# Altium project B6_32D_20230729.PrjPcb
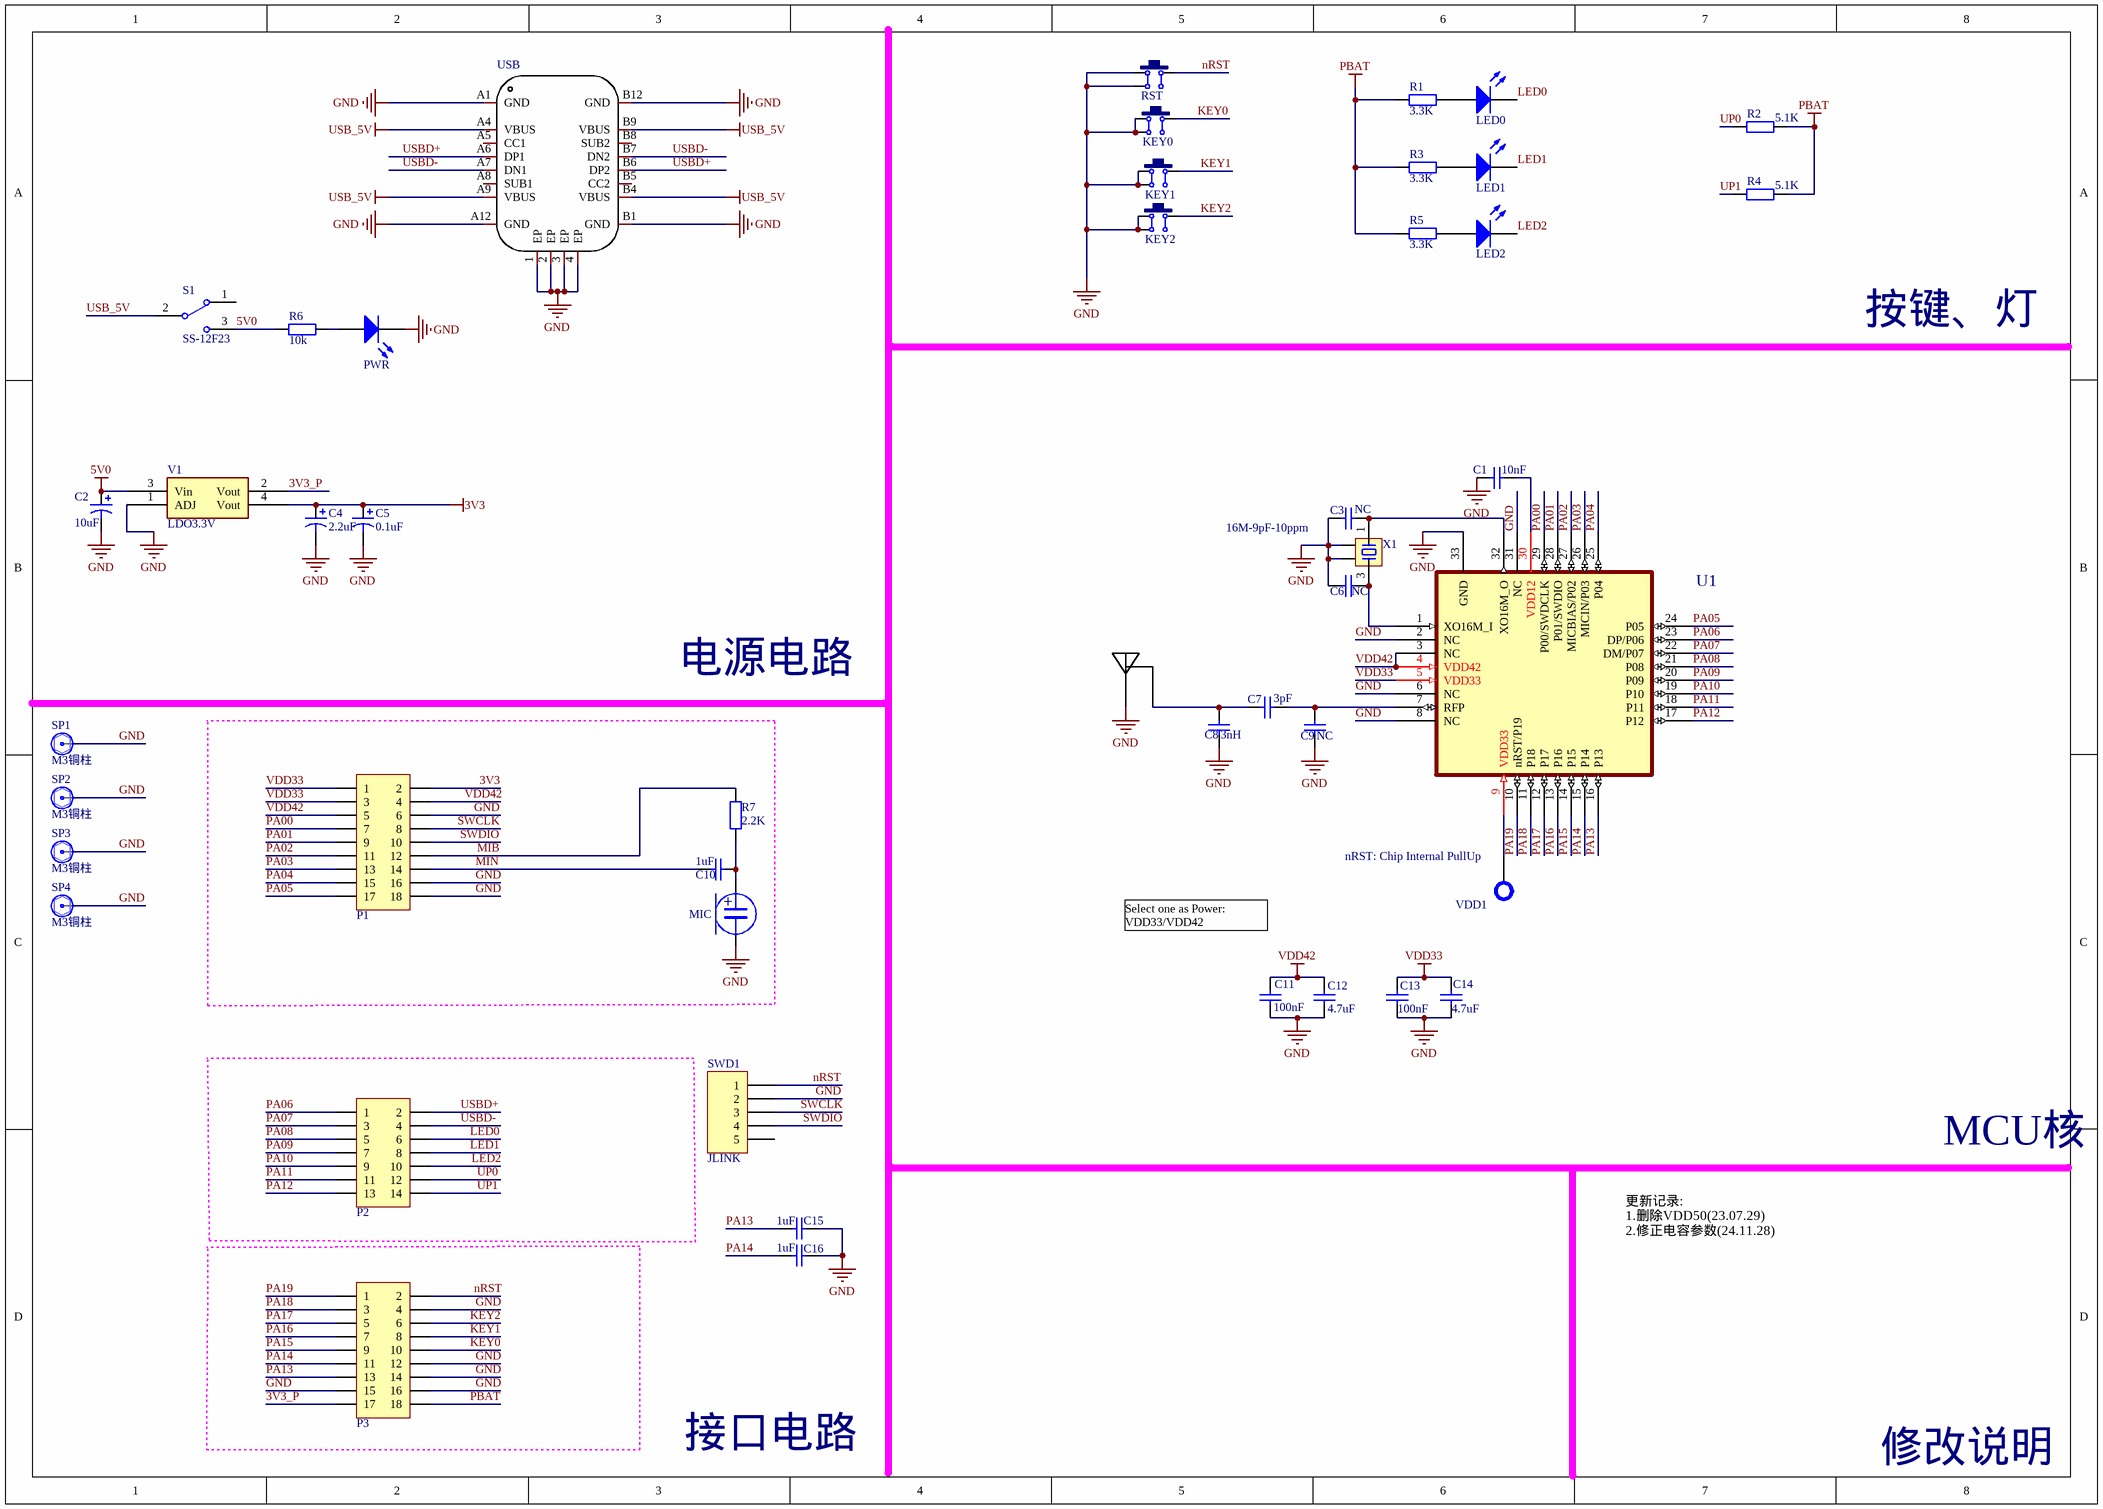
[diagram p0: B6_32D_20230729.SchDoc]
1 sheet, 47 parts. Net scope: global (net labels, ports and power ports of the same name join across sheets).
Board file: B6_32D_20230729.PcbDoc

## Sheet B6_32D_20230729.SchDoc: B6_32 Development Board
size A3; Date: 2023.07.28; Revision: V1.1; Rule: PcbType=ProtelPcb; Rule: PcbType=ProtelPcb; Rule: PcbType=ProtelPcb

### Parts
ANT1  ANT1  [常用2.4G天线7]  (value not drawn)
C1  10nF  [C0603]
C2  10uF  [C0603]
C3  NC  [C0603]
C4  2.2uF  [C0603]
C5  0.1uF  [C0603]
C6  NC  [C0603]
C7  3pF  [C0402]
C8  3nH  [C0402]
C9  NC  [C0402]
C10  1uF  [C0603]
C11  100nF  [C0603]
C12  4.7uF  [C0603]
C13  100nF  [C0603]
C14  4.7uF  [C0603]
C15  1uF  [C0603]
C16  1uF  [C0603]
KEY0  6x6x5  [SW-SMD]  (value not drawn)
KEY1  6x6x5  [SW-SMD]  (value not drawn)
KEY2  6x6x5  [SW-SMD]  (value not drawn)
LED0  *  [LED_0603]  (value not drawn)
LED1  *  [LED_0603]  (value not drawn)
LED2  *  [LED_0603]  (value not drawn)
MIC  MIC-6*5mm  [MIC-6*5.5mm]  (value not drawn)
P1  Header 2X11  [HDR2.54-LI-2x9P]  (value not drawn)
P2  Header 2X7  [HDR2.54-LI-2x7P]  (value not drawn)
P3  Header 2X11  [HDR2.54-LI-2x9P]  (value not drawn)
PWR  *  [LED_0603]  (value not drawn)
R1  3.3K  [R 0603_L]
R2  5.1K  [R 0603_L]
R3  3.3K  [R 0603_L]
R4  5.1K  [R 0603_L]
R5  3.3K  [R 0603_L]
R6  10k  [RESC_0603]
R7  2.2K  [R 0603_L]
RST  6x6x5  [SW-SMD]  (value not drawn)
S1  SS-12F23  [SK12D07VG3]
SP1  M3铜柱  [M3x21+6_L]
SP2  M3铜柱  [M3x21+6_L]
SP3  M3铜柱  [M3x21+6_L]
SP4  M3铜柱  [M3x21+6_L]
SWD1  JLINK  [HDR2.54-LI-5P]
U1  C1_QFN32  [QFN32L_0404x0.75-0.40]  (value not drawn)
USB  KH-TYPE-C-16P  [USB-C-SMD_KH-TYPE-C-16P]  (value not drawn)
V1  LDO3.3V  [SOT223_L]
VDD1  HOLE  [TEST_PAD]  (value not drawn)
X1  16M-9pF-10ppm  [OSC3225-mini]

### Nets
3V3: C4.1 C5.1 P1.2 V1.4(Vout)
5V0: C2.1 R6.1 S1.3 V1.3(Vin)
GND: ANT1.1 C1.2 C2.2 C3.1 C4.2 C5.2 C6.2 C8.2 C9.2 C11.1 C12.1 C13.1 C14.2 C15.1 C16.1 KEY0.1 KEY0.4 KEY1.1 KEY1.4 KEY2.1 KEY2.4 MIC.2 P1.6 P1.16 P1.18 P3.4 P3.12 P3.14 P3.15 P3.16 PWR.2(K) RST.1 RST.4 SP1.1 SP2.1 SP3.1 SP4.1 SWD1.2 U1.2(NC) U1.6(NC) U1.8(NC) U1.31(NC) U1.33(GND) USB.1(EP) USB.2(EP) USB.3(EP) USB.4(EP) USB.A1(GND) USB.A12(GND) USB.B1(GND) USB.B12(GND) V1.1(ADJ) X1.2 X1.4
PBAT: P3.18 R1.1 R2.1 R3.1 R4.1 R5.1
USB_5V: S1.2 USB.A4(VBUS) USB.A9(VBUS) USB.B4(VBUS) USB.B9(VBUS)
VDD33: C13.2 C14.1 P1.1 P1.3 U1.5(VDD33)
VDD42: C11.2 C12.2 P1.4 P1.5 U1.3(NC) U1.4(VDD42)
3V3_P: P3.17 V1.2(Vout)
KEY0: KEY0.2 P3.10
KEY1: KEY1.2 P3.8
KEY2: KEY2.2 P3.6
LED0: LED0.2(K) P2.6
LED1: LED1.2(K) P2.8
LED2: LED2.2(K) P2.10
MIB: P1.12 R7.1
MIN: C10.2 P1.14
nRST: P3.2 RST.2 SWD1.1
PA00: P1.7 U1.29(P00/SWDCLK)
PA01: P1.9 U1.28(P01/SWDIO)
PA02: P1.11 U1.27(MICBIAS/P02)
PA03: P1.13 U1.26(MICIN/P03)
PA04: P1.15 U1.25(P04)
PA05: P1.17 U1.24(P05)
PA06: P2.1 U1.23(DP/P06)
PA07: P2.3 U1.22(DM/P07)
PA08: P2.5 U1.21(P08)
PA09: P2.7 U1.20(P09)
PA10: P2.9 U1.19(P10)
PA11: P2.11 U1.18(P11)
PA12: P2.13 U1.17(P12)
PA13: C15.2 P3.13 U1.16(P13)
PA14: C16.2 P3.11 U1.15(P14)
PA15: P3.9 U1.14(P15)
PA16: P3.7 U1.13(P16)
PA17: P3.5 U1.12(P17)
PA18: P3.3 U1.11(P18)
PA19: P3.1 U1.10(nRST/P19)
SWCLK: P1.8 SWD1.3
SWDIO: P1.10 SWD1.4
UP0: P2.12 R2.2
UP1: P2.14 R4.2
USBD+: P2.2 USB.A6(DP1) USB.B6(DP2)
USBD-: P2.4 USB.A7(DN1) USB.B7(DN2)
NetANT1_2: ANT1.2 C7.2 C8.1
NetC1_1: C1.1 U1.30(VDD12)
NetC3_2: C3.2 U1.32(XO16M_O) X1.1
NetC6_1: C6.1 U1.1(XO16M_I) X1.3
NetC7_1: C7.1 C9.1 U1.7(RFP)
NetC10_1: C10.1 MIC.1 R7.2
NetLED0_1: LED0.1(A) R1.2
NetLED1_1: LED1.1(A) R3.2
NetLED2_1: LED2.1(A) R5.2
NetPWR_1: PWR.1(A) R6.2
NetU1_9: U1.9(VDD33) VDD1.1(HOLE)

Not connected (* = marked no-connect by the designer): KEY0 3; KEY1 3; KEY2 3; RST 3; S1 1; SWD1 5; USB A5(CC1) A8(SUB1) B5(CC2) B8(SUB2)

### Notes on the sheet
- 按键、灯
- 电源电路
- (near VDD1) nRST: Chip Internal PullUp
- Select one as Power:
  VDD33/VDD42
- MCU核
- 更新记录:
  1.删除VDD50(23.07.29)
  2.修正电容参数(24.11.28)
- 接口电路
- 修改说明
- Title:
- File:
- Size:
- A3
- Date:
- Revision:
- CompanyName:
- (in symbol MIC1) +

### Library data of the parts
ANT1 = ANT_PCB2
C1 C3 C6-C12 C14-C16 = Cap: Capacitor (Semiconductor SIM Model); Value: *
C2 C4 C5 = Cap Pol3: Polarized Capacitor (Surface Mount); Published: 8-Jun-2000; LatestRevisionDate: 29-May-2009; LatestRevisionNote: IPC-7351 Footprint Added.; PackageReference: C0805; Publisher: Altium Limited; PackageDescription: Chip Capacitor
C13 = Cap Semi: Capacitor (Semiconductor SIM Model); Published: 8-Jun-2000; LatestRevisionDate: 29-May-2009; LatestRevisionNote: IPC-7351 Footprint Added.; PackageReference: C1206; Publisher: Altium Limited; PackageDescription: Chip Capacitor; Value: 100nF
KEY0-KEY2 RST = TSW SMD-6x6: 贴片6x6轻触开关; 版权归属: 封装库来自淘宝 ID：黄晶宝石; BOM名称: 贴片6x6轻触开关; 唯一出售店铺网址: https://shop463601444.taobao.com
LED0-LED2 PWR = LED: 发光二极管; value: *
MIC = MIC1: 电容麦克风; 版权归属: 封装库来自淘宝 ID：黄晶宝石; BOM名称: 电容麦克风; 学习资源: https://shop463601444.taobao.com
P1 P3 = Header 9X2: 9*2P接插件; 版权归属: 淘宝ID:黄晶宝石; BOM名称: 9*2P接插件; 学习资源: https://shop463601444.taobao.com
P2 = Header 7X2: 7*2P接插件; 版权归属: 封装库来自淘宝 ID：黄晶宝石; BOM名称: 7*2P接插件; 学习资源: https://shop463601444.taobao.com
R1-R5 = Res: 贴片电阻; value: *
R6 R7 = Res: 贴片电阻; value: 1k
S1 = SSW-1P: 1路波动开关; pin to pad: 1>3 2>1 3>2; BOM名称: 波动开关; 版权归属: 封装库来自淘宝 ID：黄晶宝石; 学习资源: https://shop463601444.taobao.com
SP1 = 铜柱加头小焊盘: 铜柱; BOM名称: 铜柱
SP2-SP4 = 铜柱加头小焊盘: 铜柱; 版权归属: 封装库来自淘宝 ID：黄晶宝石; BOM名称: 铜柱; 学习资源: https://shop463601444.taobao.com
SWD1 = Header 5: Header, 5-Pin; LatestRevisionDate: 17-Jul-2002; LatestRevisionNote: Re-released for DXP Platform.; Publisher: Altium Limited
U1 = C1_QFN32: HY Dragon C 蓝牙芯片, QFN32_4x4
USB = KH-TYPE-C-16P: 连接器类型:Type-C;标准:-;公母:母座;触点数量:16;端口数量:1;安装方式:卧贴;额定电流 - 电源:3A;工作温度范围:-40~+85;; Manufacturer: kinghelm(金航标); Add into BOM: yes; Connector Type: Type-C; Gender: 母座; Number of Contacts: 16; Number of Ports: 1; Current Rating - Power (Max): 3A; Name: KH-TYPE-C-16P; Symbol: KH-TYPE-C-16P; Device: KH-TYPE-C-16P; LCSC Part Name: Type-C 母座 卧贴; Supplier Part: C709357; Manufacturer Part: KH-TYPE-C-16P; Supplier Footprint: SMD; JLCPCB Part Class: 扩展库; Datasheet: https://atta.szlcsc.com/upload/public/pdf/source/20200911/C709357_AA8DCEB38BB20E3035A7ED7AE7667837.pdf; Supplier: LCSC; Convert to PCB: yes; Standard: -; Mounting Style: 卧贴; Operating Temperature Range: -40~+85
V1 = AMS1117: LDO 可调节稳压芯片; value: *
VDD1 = HOLE: 定位孔
X1 = XTAL-4P: 4脚无源晶振; 版权归属: 封装库来自淘宝卖家 ID：黄晶宝石; BOM名称: 4脚无源晶振; 学习资源: https://shop463601444.taobao.com